# EAGLE schematic untitled (EAGLE 8.4.3)
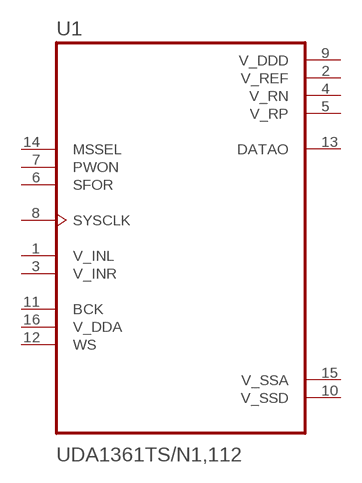
[diagram p0: schematic, sheet 1]

## Parts
U1  UDA1361TS/N1,112  [SOP65P640X120-16N]
Unconnected: U1.1(V_INL) U1.3(V_INR) U1.6(SFOR) U1.7(PWON) U1.8(SYSCLK) U1.11(BCK) U1.12(WS) U1.13(DATAO) U1.14(MSSEL) U1.16(V_DDA)

## Power pins joined to a net without a drawn wire
V_DDD: U1.9(V_DDD)
V_REF: U1.2(V_REF)
V_RN: U1.4(V_RN)
V_RP: U1.5(V_RP)
V_SSA: U1.15(V_SSA)
V_SSD: U1.10(V_SSD)

## Library data of the parts
U1 = UDA1361TS_N1_112:UDA1361TS/N1,112: None; AVAILABILITY: Good; DESCRIPTION: Data acquisition IC - ADC NXP Semiconductors UDA1361TS/N1, 112 24 Bit SSOP 16; MF: NXP Semiconductors; MP: UDA1361TS/N1,112; PACKAGE: SSOP-16 NXP Semiconductors; PRICE: 1.23 USD